# Altium schematic sheet Power Supply.SchDoc
size A4
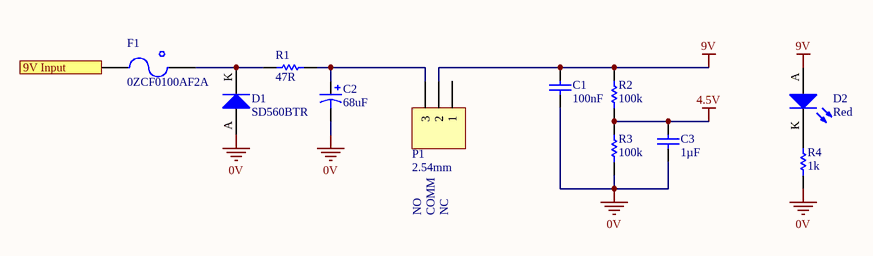
[diagram p0: Power Supply.SchDoc]

## Parts
C1  100nF  [0805]
C2  68uF  [2924]
C3  1µF  [0805]
D1  SD560BTR  [SMB Diode]
D2  Red  [0805 LED]
F1  0ZCF0100AF2A  [2920]
P1  2.54mm  [TH 2.54mm Header 1x3]
R1  47R  [2512]
R2  100k  [0805]
R3  100k  [0805]
R4  1k  [0805]

## Ports
9V Input

## Nets
0V: C1.2 C2.1 C3.1 D1.A R3.1 R4.1
4.5V: C3.2 R2.1 R3.2
9V: C1.1 D2.A P1.2 R2.2
9V Input: F1.1 ; port 9V Input
NetC2_2: C2.2 P1.3 R1.2
NetD1_K: D1.K F1.2 R1.1
NetD2_K: D2.K R4.2

Not connected (* = marked no-connect by the designer): P1 1

## Notes on the sheet
- NO
- COMM
- NC

## Library data of the parts
C1 = GCM21BR71H104KA37L: Manufacturer: muRata; Tolerance: ±10%; Material: X7R; Rated Voltage: 50V; Part Number: GCM21BR71H104KA37L; Value: 100nF; Digikey Part Number: 490-6064-1-ND
C2 = TAJV686K035RNJ: Manufacturer: AVX Corporation; Tolerance: 10%; Material: Tantalum; Rated Voltage: 35V; Part Number: TAJV686K035RNJ; Value: 68uF; Digikey Part Number: 478-13135-1-ND
C3 = GCM21BR71H105KA03L: Manufacturer: muRata; Tolerance: ±10%; Material: X7R; Rated Voltage: 50V; Part Number: GCM21BR71H105KA03L; Value: 1µF; Digikey Part Number: 490-10675-1-ND
D1 = SD560BTR: 1.2V_F 600V 5A SMB; Manufacturer: SMC Diode Solutions; Part Number: SD560BTR; Digikey Part Number: 1655-1530-2-ND; Digikey Link: https://www.digikey.com/product-detail/en/smc-diode-solutions/SD560BTR/1655-1530-2-ND/6022620
D2 = SML-210LTT86: Red LED Indication - Discrete 1.75V 0805 (2012 Metric); Manufacturer: ROHM Semiconductor; Part Number: SML-210LTT86; Colour: Red; Digikey Part Number: 511-1286-1-ND; Digikey Link: https://www.digikey.com/product-detail/en/rohm-semiconductor/SML-210LTT86/511-1286-1-ND/637099
F1 = 0ZCF0100AF2A: PTC RESET FUSE 60V 1A 292; Manufacturer: Littelfuse Inc.; Part Number: 0ZCF0100AF2A; Digikey Part Number: 507-2070-1-ND; Digikey Link: https://www.digikey.com/product-detail/en/bel-fuse-inc/0ZCF0100AF2A/507-2070-1-ND/6210547
P1 = TH 2.54mm Header 1x3: Positions: 3; Angle: 0; Flange: No; Contact: NA; Part Number: TH 2.54mm Header 1x3; Pitch: 2.54mm; Row Spacing: 2.54mm
R1 = 352147RFT: Manufacturer: TE Connectivity; Tolerance: 0.01; Rated Voltage: 2W; Part Number: 352147RFT; Value: 47R; Digikey Part Number: A116000CT-ND
R2 R3 = RC0805FR07100KL: Manufacturer: YAGEO; Tolerance: 0.01; Rated Voltage: 0.125W; Part Number: RC0805FR07100KL; Value: 100k; Material: FR-07; Digikey Part Number: 311-100KCRCT-ND
R4 = RC0805FR071KL: Manufacturer: YAGEO; Tolerance: 0.01; Rated Voltage: 0.125W; Part Number: RC0805FR071KL; Value: 1k; Material: FR-07; Digikey Part Number: 311-1.00KCRCT-ND